# EAGLE design tdt_maleToMale (EAGLE 8.1.0)
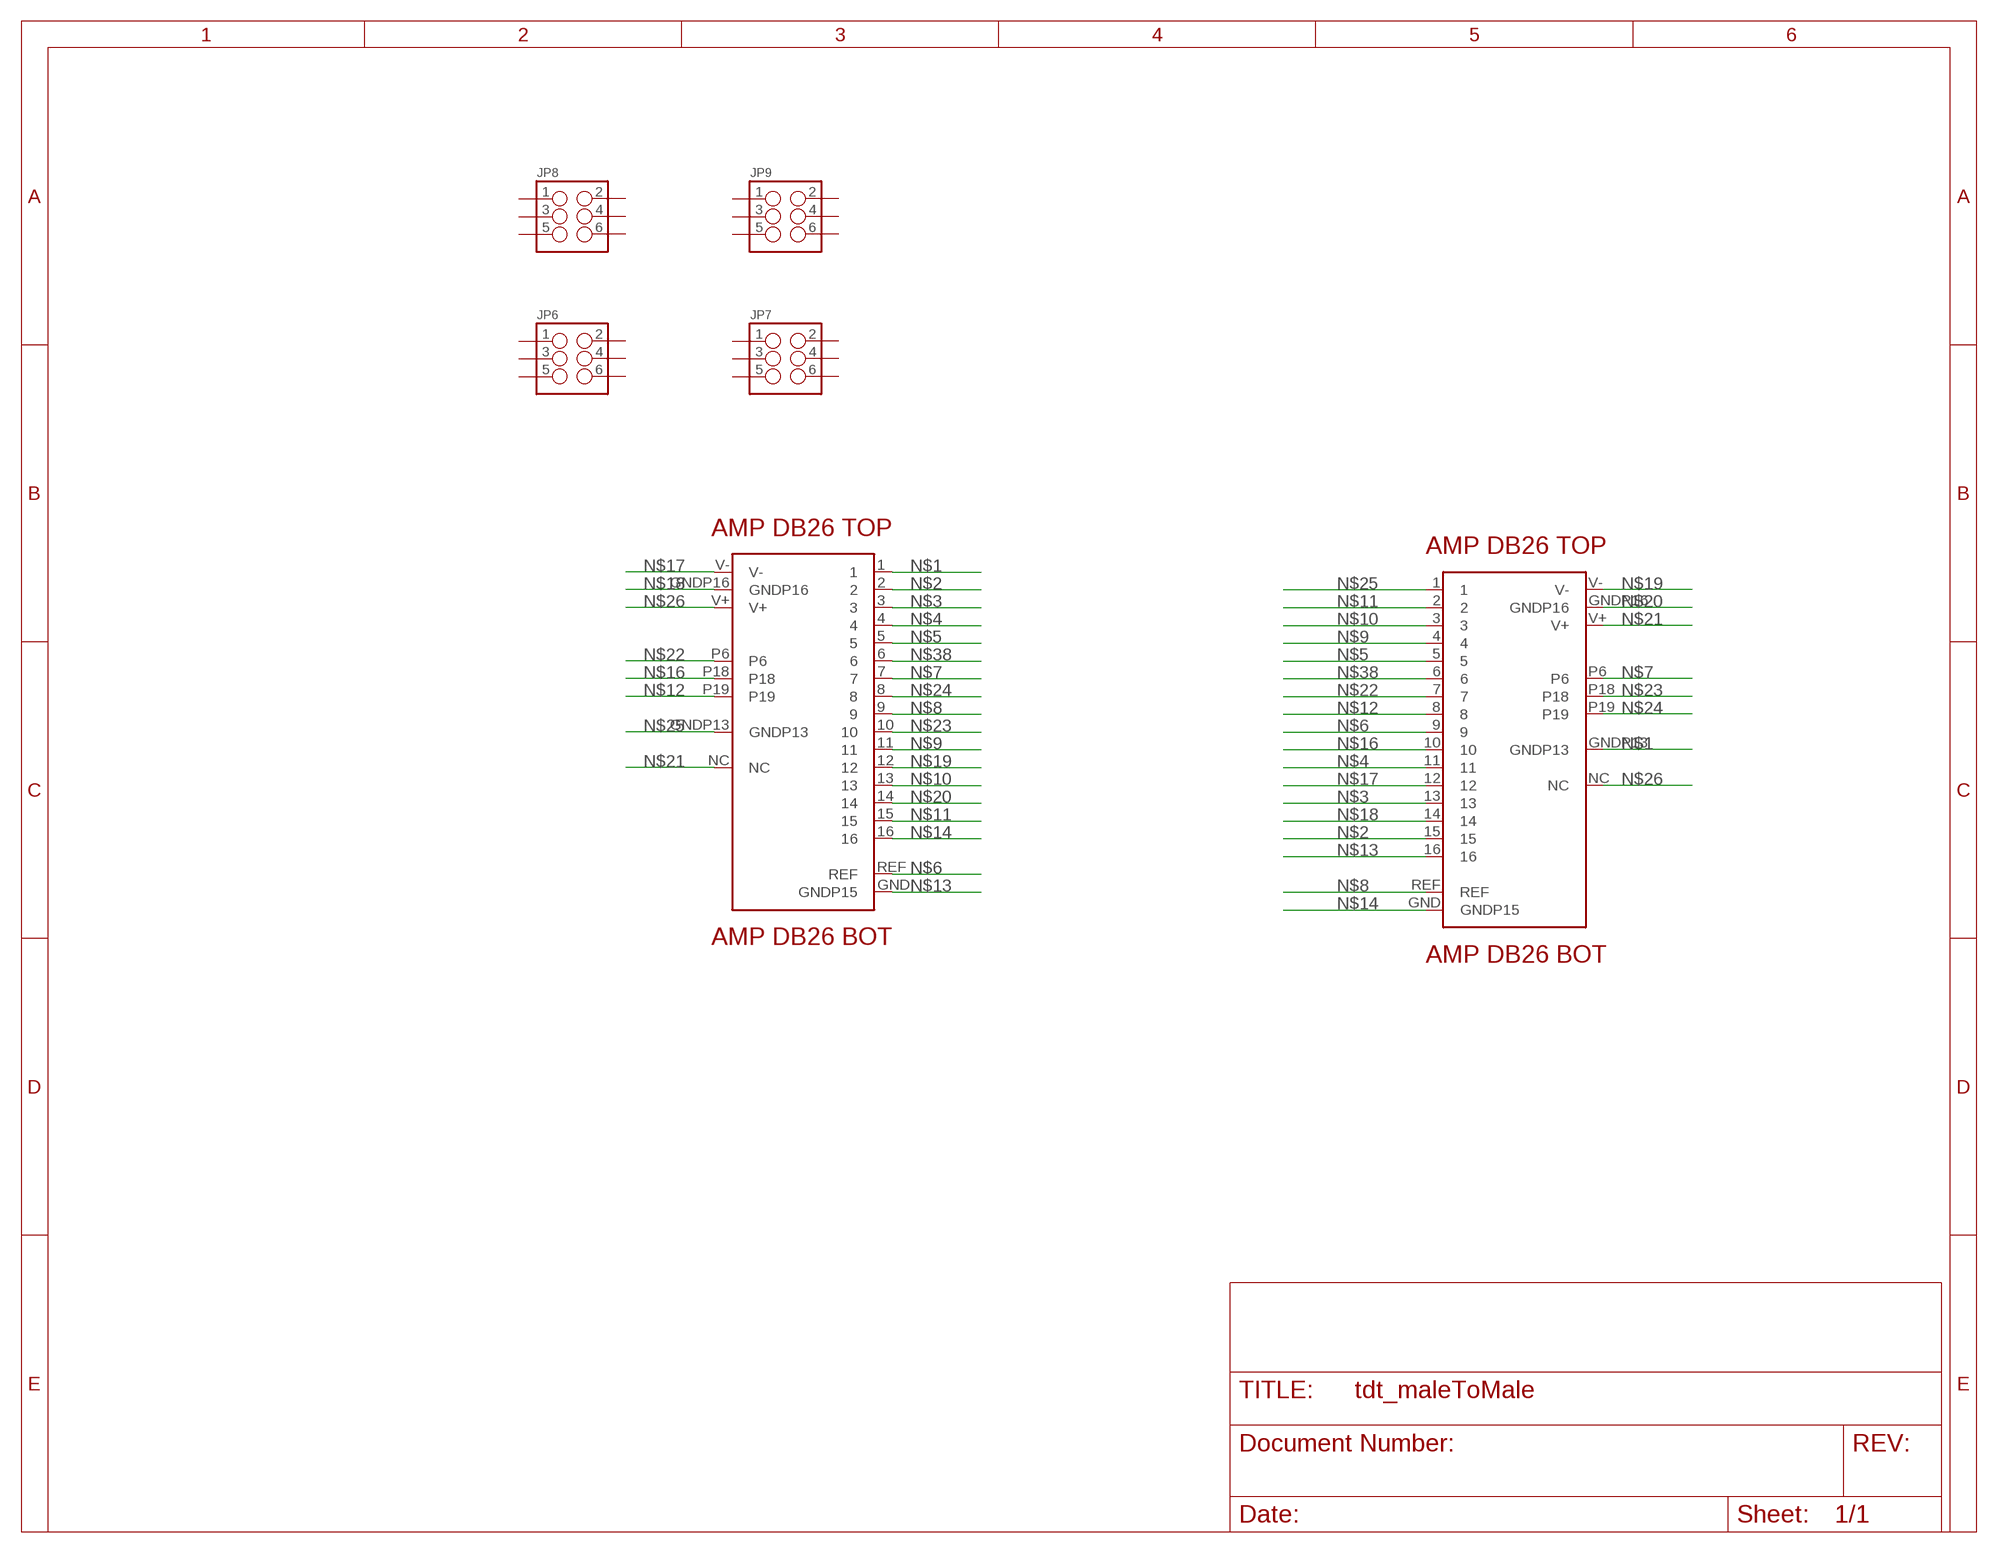
[diagram p0: schematic, sheet 1]

## Parts
JP6  M03X22X3_SILK_MALE_PTH  [2X3]
JP7  M03X22X3_SILK_MALE_PTH  [2X3]
JP8  M03X22X3_SILK_MALE_PTH  [2X3]
JP9  M03X22X3_SILK_MALE_PTH  [2X3]
U$1  DB26-MALE-BOT  [DB26-MALE-BOT]
U$2  DB26-MALE-TOP  [DB26-MALE-TOP]
U$3  DB26-MALE-TOP  [DB26-MALE-TOP]
U$4  DB26-MALE-BOT  [DB26-MALE-BOT]

## Nets
N$1: U$2.1 U$3.GNDP13
N$2: U$2.2 U$3.15
N$3: U$2.3 U$3.13
N$4: U$2.4 U$3.11
N$5: U$2.5 U$3.5
N$6: U$2.REF U$3.9
N$7: U$2.7 U$3.P6
N$8: U$2.9 U$3.REF
N$9: U$2.11 U$3.4
N$10: U$2.13 U$3.3
N$11: U$2.15 U$3.2
N$12: U$1.P19 U$4.8
N$13: U$1.GND(GNDP15) U$4.16
N$14: U$1.16 U$4.GND(GNDP15)
N$16: U$1.P18 U$4.10
N$17: U$1.V- U$4.12
N$18: U$1.GNDP16 U$4.14
N$19: U$1.12 U$4.V-
N$20: U$1.14 U$4.GNDP16
N$21: U$1.NC U$4.V+
N$22: U$2.P6 U$3.7
N$23: U$1.10 U$4.P18
N$24: U$1.8 U$4.P19
N$25: U$2.GNDP13 U$3.1
N$26: U$1.V+ U$4.NC
N$38: U$1.6 U$4.6
Unconnected: JP6.1 JP6.2 JP6.3 JP6.4 JP6.5 JP6.6 JP7.1 JP7.2 JP7.3 JP7.4 JP7.5 JP7.6 JP8.1 JP8.2 JP8.3 JP8.4 JP8.5 JP8.6 JP9.1 JP9.2 JP9.3 JP9.4 JP9.5 JP9.6

## Library data of the parts
JP6-JP9 = SparkFun-Connectors:M03X2: 2x3 .1" header. Shrouded, with keying- CONN-10681 SMT- CONN-11415 Pogo pins- HW-11044; PROD_ID: CONN-09701
U$1 U$4 = HDMI-DB26:DB26-MALE-BOT
U$2 U$3 = HDMI-DB26:DB26-MALE-TOP

## Board
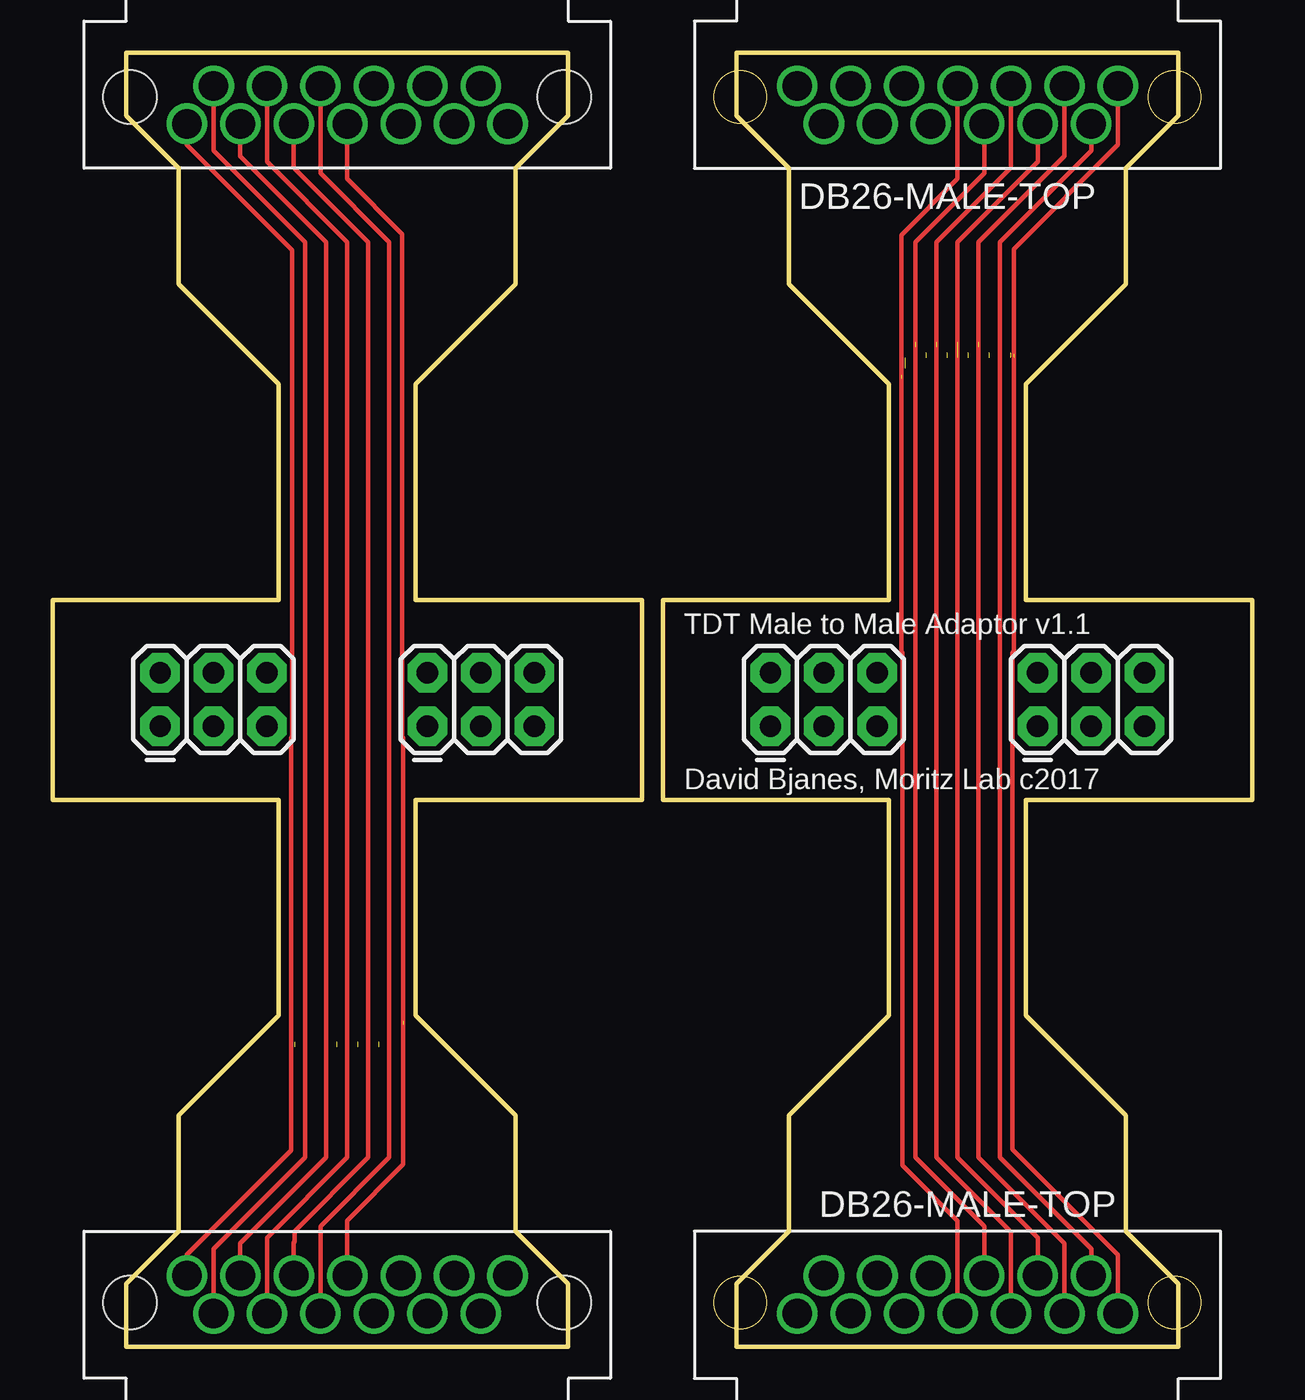
[diagram p1: board, top side]
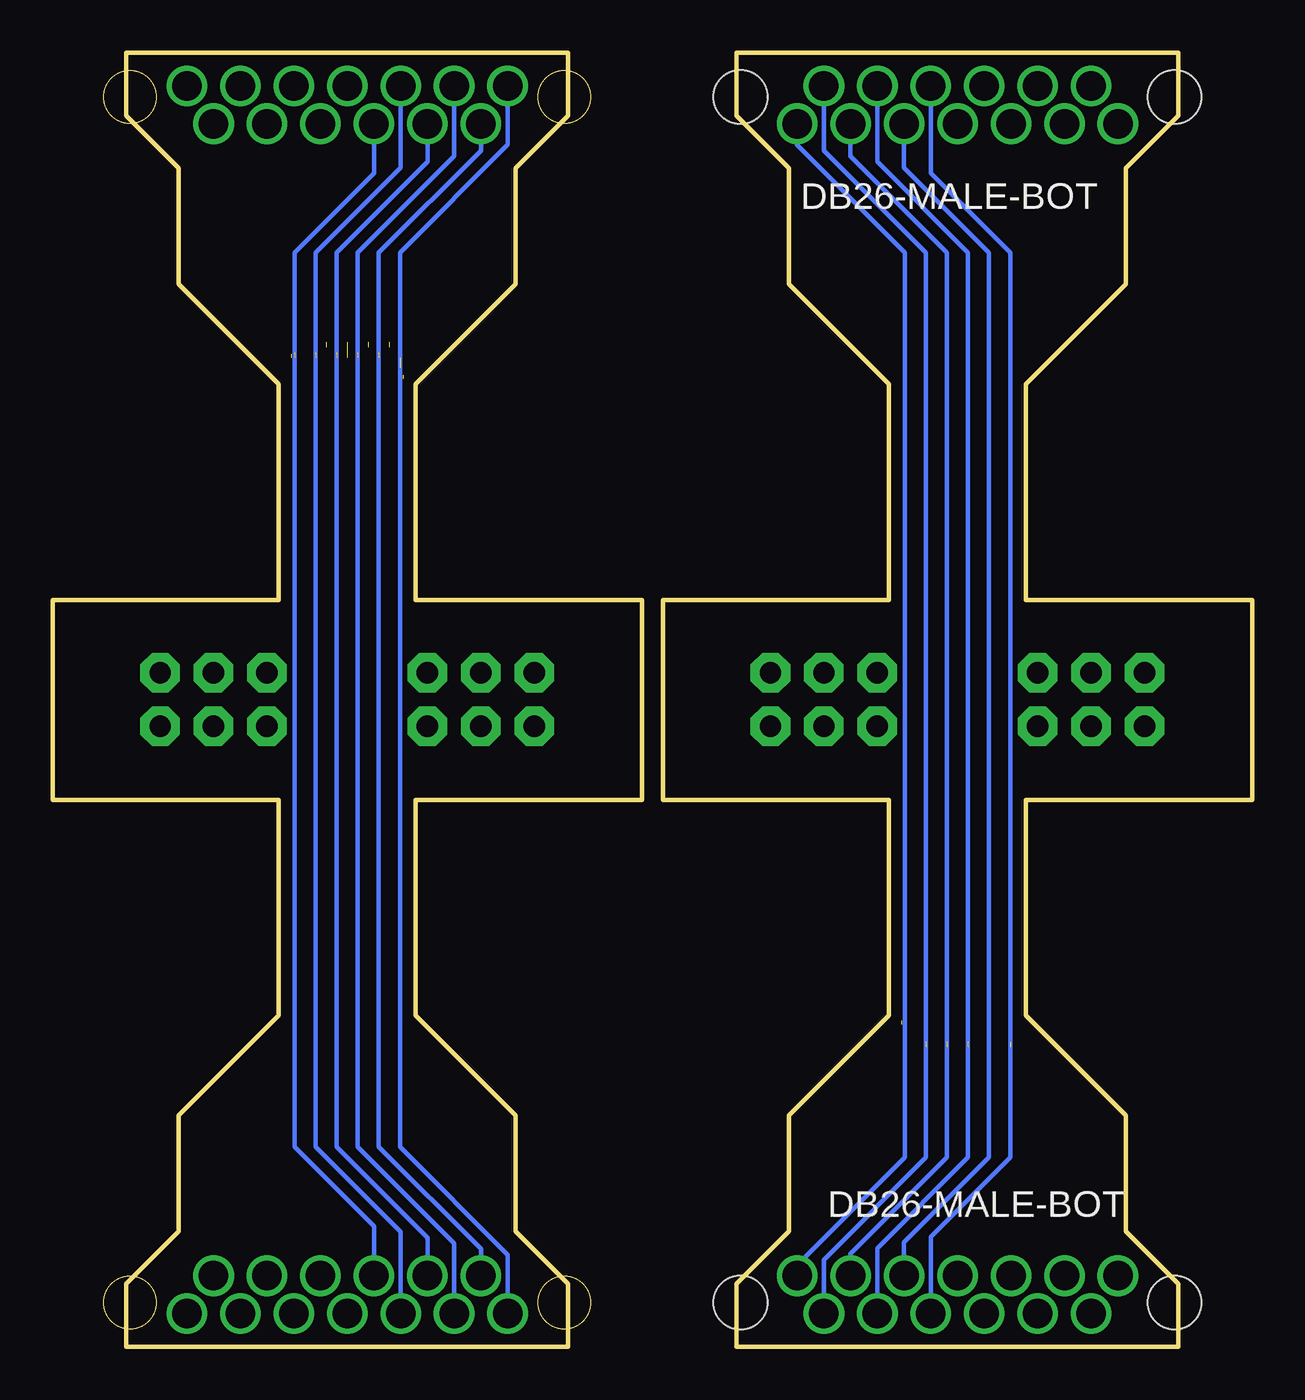
[diagram p2: board, bottom side, seen from below]

Size 57 x 61.5 mm. Coordinates in mm from the lower left corner, seen from the top.
Outline: 28,26 28,35.5 17.25,35.5 17.25,45.75 22,50.5 22,56 24.5,58.5 24.5,61.5 3.5,61.5 3.5,58.5 6,56 6,50.5 10.75,45.75 10.75,35.5 0,35.5 0,26 10.75,26 10.75,15.75 6,11 6,5.5 3.5,3 3.5,0 24.5,0 24.5,3 22,5.5 22,11 17.25,15.75 17.25,26 28,26
Outline: 53.5,0 32.5,0 32.5,3 35,5.5 35,11 39.75,15.75 39.75,26 29,26 29,35.5 39.75,35.5 39.75,45.75 35,50.5 35,56 32.5,58.5 32.5,61.5 53.5,61.5 53.5,58.5 51,56 51,50.5 46.25,45.75 46.25,35.5 57,35.5 57,26 46.25,26 46.25,15.75 51,11 51,5.5 53.5,3 53.5,0
Copper layers (1*16): Top 0.0356mm / dielectric 1.5011mm / Bottom 0.0356mm
Design rules "oshpark-2layer *": minimum track width 6mil, minimum drill 13mil, track to track 6mil, track to pad 6mil, pad to pad 6mil, via to via 6mil, smd to smd 6mil, copper to edge 15mil, drill to drill 6mil, minimum pad ring 7mil, minimum via ring 7mil, stop-mask expansion 2.5mil, vias tented up to drill 0mil, thermal gap 10mil

### Footprints (pad centres in the part's own frame; a part is rotated, then mirrored left to right if it is on the bottom)
2X3 = drill 1.016 pad 1.88 octagon: 1 0,0; 2 0,2.54; 3 2.54,0; 4 2.54,2.54; 5 5.08,0; 6 5.08,2.54
DB26-MALE-BOT = drill 1.4 pad 1.93: 6 0,2.12; 8 -1.27,3.92; 10 -2.54,2.12; 12 -3.81,3.92; 14 -5.08,2.12; 16 -6.35,3.92; GND 6.35,3.92; GNDP16 5.08,2.12; NC -7.62,2.12; P18 2.54,2.12; P19 1.27,3.92; V+ 7.62,2.12; V- 3.81,3.92 | hole 2.54: 10.316,3.394; -10.316,3.394
DB26-MALE-TOP = drill 1.4 pad 1.93: 1 7.62,3.92; 2 6.35,2.12; 3 5.08,3.92; 4 3.81,2.12; 5 0,3.92; 7 -1.27,2.12; 9 -2.54,3.92; 11 -3.81,2.12; 13 -5.08,3.92; 15 -6.35,2.12; GNDP13 -7.62,3.92; P6 1.27,2.12; REF 2.54,3.92

### Placement (x,y rotation side)
JP6  34.11,29.5 0 top
JP7  46.81,29.5 0 top
JP8  5.11,29.5 0 top
JP9  17.81,29.5 0 top
U$1  14,5.5 180 top
U$2  43,5.5 180 top
U$3  43,56 0 top
U$4  14,56 0 top

### Tracks (layer width: path | path; a pad name or v marks a point on that pad's centre or on a via)
N$1  (1 unrouted)
  Bottom 0.203: 40.5,47 40.5,9.5 35.38,4.38 U$2.1 | 40.5,46.5 40.5,52 35.38,57.12 U$3.GNDP13
N$2  (1 unrouted)
  Bottom 0.203: 41.5,47.25 41.5,9.5 36.65,4.65 U$2.2 | 41.5,47 41.5,52 36.65,56.85 U$3.15
N$3  (1 unrouted)
  Bottom 0.203: 42.5,47.25 42.5,9.5 37.92,4.92 U$2.3 | 42.5,47 42.5,52 37.92,56.58 U$3.13
N$4  (1 unrouted)
  Bottom 0.203: 43.5,47.25 43.5,9.5 39.19,5.19 U$2.4 | 43.5,47 43.5,52 39.19,56.31 U$3.11
N$5  (1 unrouted)
  Top 0.203: 40.33,46.17 40.33,33.04 40.38,32.99 40.38,8.62 43,6 U$2.5 | 40.33,46 40.33,52.83 43,55.5 U$3.5
N$6  (1 unrouted)
  Bottom 0.203: 44.5,47.25 44.5,9.5 40.46,5.46 U$2.REF | 44.5,47 44.5,52 40.46,56.04 U$3.9
N$7  (1 unrouted)
  Top 0.203: 41,47.75 41,9 44.27,5.73 U$2.7 | 41,47.5 41,52.5 44.27,55.77 U$3.P6
N$8  (1 unrouted)
  Top 0.203: 42,47.75 42,9 45.54,5.46 U$2.9 | 42,47.5 42,52.5 45.54,56.04 U$3.REF
N$9  (1 unrouted)
  Top 0.203: 43,47.75 43,9 46.81,5.19 U$2.11 | 43,47 43,52.5 46.81,56.31 U$3.4
N$10  (1 unrouted)
  Top 0.203: 44,47.75 44,9 48.08,4.92 U$2.13 | 44,47.5 44,52.5 48.08,56.58 U$3.3
N$11
  Top 0.203: U$2.15 49.35,4.65 45,9 45,52.5 49.35,56.85 U$3.2
N$12
  Top 0.203: U$4.8 12.73,55.77 16,52.5 16,9 12.73,5.73 U$1.P19
N$13
  Top 0.203: U$4.16 7.65,56.85 12,52.5 12,9 7.65,4.65 U$1.GND
N$14  (1 unrouted)
  Bottom 0.203: 15.5,14.25 15.5,52 20.35,56.85 U$4.GND | 15.5,14.5 15.5,9 20.35,4.15 U$1.16
N$16
  Top 0.203: U$4.10 11.46,56.04 15,52.5 15,9 11.5,5.5 11.5,5 11.46,4.96 U$1.P18
N$17
  Top 0.203: U$4.12 10.19,56.31 14,52.5 14,9 10.19,5.19 U$1.V-
N$18
  Top 0.203: U$4.14 8.92,56.58 13,52.5 13,13.75 13,9 8.92,4.92 U$1.GNDP16
N$19  (1 unrouted)
  Bottom 0.203: 13.5,14.25 13.5,52 17.81,56.31 U$4.V- | 13.5,14.5 13.5,9 17.81,4.69 U$1.12
N$20  (1 unrouted)
  Bottom 0.203: 14.5,14.25 14.5,52 19.08,56.58 U$4.GNDP16 | 14.5,14.5 14.5,9 19.08,4.42 U$1.14
N$21
  Bottom 0.203: U$4.V+ 21.62,57.12 16.5,52 16.5,9 21.62,3.88 U$1.NC
N$22  (1 unrouted)
  Bottom 0.203: 45.5,47.25 45.5,9.5 41.73,5.73 U$2.P6 | 45.5,47 45.5,52 41.73,55.77 U$3.7
N$23
  Bottom 0.203: U$4.P18 16.54,56.04 12.5,52 12.5,9 16.54,4.96 U$1.10
N$24  (1 unrouted)
  Bottom 0.203: 11.5,14.25 11.5,52 15.27,55.77 U$4.P19 | 11.5,14.5 11.5,9 15.27,5.23 U$1.8
N$25  (1 unrouted)
  Top 0.203: 45.67,47.17 45.67,33.04 45.62,32.99 45.62,9.38 50.62,4.38 U$2.GNDP13 | 45.67,47 45.67,52.17 50.62,57.12 U$3.1
N$26
  Top 0.203: U$4.NC 6.38,57.12 11.38,52.12 11.38,29.01 11.33,28.96 11.33,9.33 6.38,4.38 U$1.V+
N$38  (1 unrouted)
  Top 0.203: 16.67,15.33 16.67,28.96 16.62,29.01 16.62,52.88 14,55.5 U$4.6 | 16.67,15.5 16.67,8.67 14,6 U$1.6

### Text on the board
tNames: TDT Male to Male Adaptor v1.1 | David Bjanes, Moritz Lab c2017